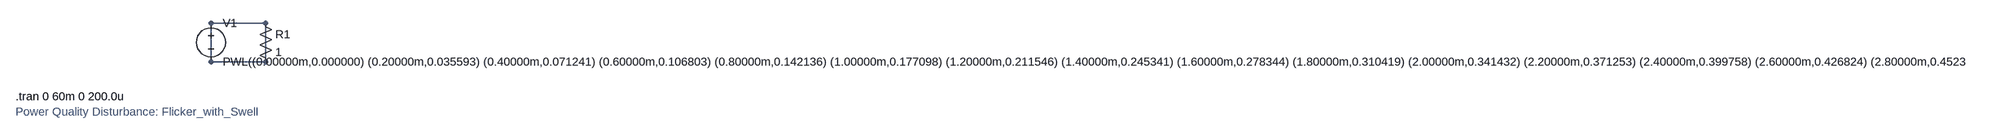
[diagram p0: schematic Flicker_with_Swell.asc]
Flicker_with_Swell.asc, the LTspice schematic file:
Version 4
SHEET 1 880 680
WIRE 192 128 80 128
WIRE 80 128 80 208
WIRE 192 208 80 208
WIRE 192 128 192 208
SYMBOL voltage 80 112 R0
WINDOW 123 0 0 Left 0
WINDOW 39 0 0 Left 0
SYMATTR InstName V1
SYMATTR Value PWL((0.00000m,0.000000) (0.20000m,0.035593) (0.40000m,0.071241) (0.60000m,0.106803) (0.80000m,0.142136) (1.00000m,0.177098) (1.20000m,0.211546) (1.40000m,0.245341) (1.60000m,0.278344) (1.80000m,0.310419) (2.00000m,0.341432) (2.20000m,0.371253) (2.40000m,0.399758) (2.60000m,0.426824) (2.80000m,0.452336) (3.00000m,0.476183) (3.20000m,0.498261) (3.40000m,0.518473) (3.60000m,0.536727) (3.80000m,0.552941) (4.00000m,0.567038) (4.20000m,0.578952) (4.40000m,0.588622) (4.60000m,0.596000) (4.80000m,0.601044) (5.00000m,0.603722) (5.20000m,0.604011) (5.40000m,0.601898) (5.60000m,0.597380) (5.80000m,0.590464) (6.00000m,0.581165) (6.20000m,0.569509) (6.40000m,0.555531) (6.60000m,0.539278) (6.80000m,0.520802) (7.00000m,0.500169) (7.20000m,0.477451) (7.40000m,0.452729) (7.60000m,0.426094) (7.80000m,0.397644) (8.00000m,0.367486) (8.20000m,0.335732) (8.40000m,0.302505) (8.60000m,0.267930) (8.80000m,0.232141) (9.00000m,0.195277) (9.20000m,0.157481) (9.40000m,0.118902) (9.60000m,0.079692) (9.80000m,0.040005) (10.00000m,0.000000) (10.20000m,-0.040164) (10.40000m,-0.080326) (10.60000m,-0.120323) (10.80000m,-0.159995) (11.00000m,-0.199181) (11.20000m,-0.237721) (11.40000m,-0.275457) (11.60000m,-0.312234) (11.80000m,-0.347901) (12.00000m,-0.382310) (12.20000m,-0.415318) (12.40000m,-0.446787) (12.60000m,-0.476586) (12.80000m,-0.504587) (13.00000m,-0.530674) (13.20000m,-0.554733) (13.40000m,-0.576662) (13.60000m,-0.596365) (13.80000m,-0.613756) (14.00000m,-0.628758) (14.20000m,-0.641303) (14.40000m,-0.651332) (14.60000m,-0.658799) (14.80000m,-0.663665) (15.00000m,-0.665904) (15.20000m,-0.665499) (15.40000m,-0.662444) (15.60000m,-0.656745) (15.80000m,-0.648418) (16.00000m,-0.637489) (16.20000m,-0.623996) (16.40000m,-0.607986) (16.60000m,-0.589520) (16.80000m,-0.568664) (17.00000m,-0.545498) (17.20000m,-0.520109) (17.40000m,-0.492596) (17.60000m,-0.463064) (17.80000m,-0.431628) (18.00000m,-0.398412) (18.20000m,-0.363545) (18.40000m,-0.327166) (18.60000m,-0.289417) (18.80000m,-0.250449) (19.00000m,-0.210416) (19.20000m,-0.169479) (19.40000m,-0.127801) (19.60000m,-0.085548) (19.80000m,-0.042891) (20.00000m,-0.000000) (20.20000m,0.062279) (20.40000m,0.124396) (20.60000m,0.186098) (20.80000m,0.247137) (21.00000m,0.307266) (21.20000m,0.366241) (21.40000m,0.423823) (21.60000m,0.479779) (21.80000m,0.533880) (22.00000m,0.585908) (22.20000m,0.635650) (22.40000m,0.682904) (22.60000m,0.727477) (22.80000m,0.769188) (23.00000m,0.807867) (23.20000m,0.843355) (23.40000m,0.875509) (23.60000m,0.904196) (23.80000m,0.929300) (24.00000m,0.950718) (24.20000m,0.968363) (24.40000m,0.982161) (24.60000m,0.992058) (24.80000m,0.998013) (25.00000m,1.000000) (25.20000m,0.998013) (25.40000m,0.992058) (25.60000m,0.982161) (25.80000m,0.968363) (26.00000m,0.950718) (26.20000m,0.929300) (26.40000m,0.904196) (26.60000m,0.875509) (26.80000m,0.843355) (27.00000m,0.807867) (27.20000m,0.769188) (27.40000m,0.727477) (27.60000m,0.682904) (27.80000m,0.635650) (28.00000m,0.585908) (28.20000m,0.533880) (28.40000m,0.479779) (28.60000m,0.423823) (28.80000m,0.366241) (29.00000m,0.307266) (29.20000m,0.247137) (29.40000m,0.186098) (29.60000m,0.124396) (29.80000m,0.062279) (30.00000m,0.000000) (30.20000m,-0.062192) (30.40000m,-0.124045) (30.60000m,-0.185311) (30.80000m,-0.245745) (31.00000m,-0.305104) (31.20000m,-0.363151) (31.40000m,-0.419655) (31.60000m,-0.474390) (31.80000m,-0.527141) (32.00000m,-0.577697) (32.20000m,-0.625861) (32.40000m,-0.671443) (32.60000m,-0.714264) (32.80000m,-0.754158) (33.00000m,-0.790972) (33.20000m,-0.824563) (33.40000m,-0.854804) (33.60000m,-0.881580) (33.80000m,-0.904794) (34.00000m,-0.924358) (34.20000m,-0.940205) (34.40000m,-0.952280) (34.60000m,-0.960544) (34.80000m,-0.964973) (35.00000m,-0.965560) (35.20000m,-0.962314) (35.40000m,-0.955258) (35.60000m,-0.944432) (35.80000m,-0.929889) (36.00000m,-0.911699) (36.20000m,-0.889947) (36.40000m,-0.864729) (36.60000m,-0.836160) (36.80000m,-0.804363) (37.00000m,-0.769477) (37.20000m,-0.731652) (37.40000m,-0.691049) (37.60000m,-0.647841) (37.80000m,-0.602211) (38.00000m,-0.554349) (38.20000m,-0.504456) (38.40000m,-0.452739) (38.60000m,-0.399412) (38.80000m,-0.344695) (39.00000m,-0.288813) (39.20000m,-0.231993) (39.40000m,-0.174469) (39.60000m,-0.116472) (39.80000m,-0.058238) (40.00000m,-0.000000) (40.20000m,0.040005) (40.40000m,0.079692) (40.60000m,0.118902) (40.80000m,0.157481) (41.00000m,0.195277) (41.20000m,0.232141) (41.40000m,0.267930) (41.60000m,0.302505) (41.80000m,0.335732) (42.00000m,0.367486) (42.20000m,0.397644) (42.40000m,0.426094) (42.60000m,0.452729) (42.80000m,0.477451) (43.00000m,0.500169) (43.20000m,0.520802) (43.40000m,0.539278) (43.60000m,0.555531) (43.80000m,0.569509) (44.00000m,0.581165) (44.20000m,0.590464) (44.40000m,0.597380) (44.60000m,0.601898) (44.80000m,0.604011) (45.00000m,0.603722) (45.20000m,0.601044) (45.40000m,0.596000) (45.60000m,0.588622) (45.80000m,0.578952) (46.00000m,0.567038) (46.20000m,0.552941) (46.40000m,0.536727) (46.60000m,0.518473) (46.80000m,0.498261) (47.00000m,0.476183) (47.20000m,0.452336) (47.40000m,0.426824) (47.60000m,0.399758) (47.80000m,0.371253) (48.00000m,0.341432) (48.20000m,0.310419) (48.40000m,0.278344) (48.60000m,0.245341) (48.80000m,0.211546) (49.00000m,0.177098) (49.20000m,0.142136) (49.40000m,0.106803) (49.60000m,0.071241) (49.80000m,0.035593) (50.00000m,0.000000) (50.20000m,-0.035397) (50.40000m,-0.070458) (50.60000m,-0.105047) (50.80000m,-0.139028) (51.00000m,-0.172271) (51.20000m,-0.204649) (51.40000m,-0.236037) (51.60000m,-0.266318) (51.80000m,-0.295378) (52.00000m,-0.323108) (52.20000m,-0.349407) (52.40000m,-0.374179) (52.60000m,-0.397335) (52.80000m,-0.418793) (53.00000m,-0.438477) (53.20000m,-0.456321) (53.40000m,-0.472264) (53.60000m,-0.486254) (53.80000m,-0.498248) (54.00000m,-0.508209) (54.20000m,-0.516111) (54.40000m,-0.521934) (54.60000m,-0.525667) (54.80000m,-0.527307) (55.00000m,-0.526861) (55.20000m,-0.524341) (55.40000m,-0.519769) (55.60000m,-0.513176) (55.80000m,-0.504599) (56.00000m,-0.494083) (56.20000m,-0.481680) (56.40000m,-0.467450) (56.60000m,-0.451459) (56.80000m,-0.433780) (57.00000m,-0.414491) (57.20000m,-0.393678) (57.40000m,-0.371430) (57.60000m,-0.347843) (57.80000m,-0.323016) (58.00000m,-0.297054) (58.20000m,-0.270064) (58.40000m,-0.242158) (58.60000m,-0.213449) (58.80000m,-0.184054) (59.00000m,-0.154092) (59.20000m,-0.123683) (59.40000m,-0.092948) (59.60000m,-0.062008) (59.80000m,-0.030985))
SYMBOL res 176 112 R0
SYMATTR InstName R1
SYMATTR Value 1
TEXT -320 280 Left 2 !.tran 0 60m 0 200.0u
TEXT -320 312 Left 2 ;Power Quality Disturbance: Flicker_with_Swell

The netlist it stands for:
* Flicker_with_Swell.asc
V1 N001 N001 PWL((0.00000m,0.000000) (0.20000m,0.035593) (0.40000m,0.071241) (0.60000m,0.106803) (0.80000m,0.142136) (1.00000m,0.177098) (1.20000m,0.211546) (1.40000m,0.245341) (1.60000m,0.278344) (1.80000m,0.310419) (2.00000m,0.341432) (2.20000m,0.371253) (2.40000m,0.399758) (2.60000m,0.426824) (2.80000m,0.452336) (3.00000m,0.476183) (3.20000m,0.498261) (3.40000m,0.518473) (3.60000m,0.536727) (3.80000m,0.552941) (4.00000m,0.567038) (4.20000m,0.578952) (4.40000m,0.588622) (4.60000m,0.596000) (4.80000m,0.601044) (5.00000m,0.603722) (5.20000m,0.604011) (5.40000m,0.601898) (5.60000m,0.597380) (5.80000m,0.590464) (6.00000m,0.581165) (6.20000m,0.569509) (6.40000m,0.555531) (6.60000m,0.539278) (6.80000m,0.520802) (7.00000m,0.500169) (7.20000m,0.477451) (7.40000m,0.452729) (7.60000m,0.426094) (7.80000m,0.397644) (8.00000m,0.367486) (8.20000m,0.335732) (8.40000m,0.302505) (8.60000m,0.267930) (8.80000m,0.232141) (9.00000m,0.195277) (9.20000m,0.157481) (9.40000m,0.118902) (9.60000m,0.079692) (9.80000m,0.040005) (10.00000m,0.000000) (10.20000m,-0.040164) (10.40000m,-0.080326) (10.60000m,-0.120323) (10.80000m,-0.159995) (11.00000m,-0.199181) (11.20000m,-0.237721) (11.40000m,-0.275457) (11.60000m,-0.312234) (11.80000m,-0.347901) (12.00000m,-0.382310) (12.20000m,-0.415318) (12.40000m,-0.446787) (12.60000m,-0.476586) (12.80000m,-0.504587) (13.00000m,-0.530674) (13.20000m,-0.554733) (13.40000m,-0.576662) (13.60000m,-0.596365) (13.80000m,-0.613756) (14.00000m,-0.628758) (14.20000m,-0.641303) (14.40000m,-0.651332) (14.60000m,-0.658799) (14.80000m,-0.663665) (15.00000m,-0.665904) (15.20000m,-0.665499) (15.40000m,-0.662444) (15.60000m,-0.656745) (15.80000m,-0.648418) (16.00000m,-0.637489) (16.20000m,-0.623996) (16.40000m,-0.607986) (16.60000m,-0.589520) (16.80000m,-0.568664) (17.00000m,-0.545498) (17.20000m,-0.520109) (17.40000m,-0.492596) (17.60000m,-0.463064) (17.80000m,-0.431628) (18.00000m,-0.398412) (18.20000m,-0.363545) (18.40000m,-0.327166) (18.60000m,-0.289417) (18.80000m,-0.250449) (19.00000m,-0.210416) (19.20000m,-0.169479) (19.40000m,-0.127801) (19.60000m,-0.085548) (19.80000m,-0.042891) (20.00000m,-0.000000) (20.20000m,0.062279) (20.40000m,0.124396) (20.60000m,0.186098) (20.80000m,0.247137) (21.00000m,0.307266) (21.20000m,0.366241) (21.40000m,0.423823) (21.60000m,0.479779) (21.80000m,0.533880) (22.00000m,0.585908) (22.20000m,0.635650) (22.40000m,0.682904) (22.60000m,0.727477) (22.80000m,0.769188) (23.00000m,0.807867) (23.20000m,0.843355) (23.40000m,0.875509) (23.60000m,0.904196) (23.80000m,0.929300) (24.00000m,0.950718) (24.20000m,0.968363) (24.40000m,0.982161) (24.60000m,0.992058) (24.80000m,0.998013) (25.00000m,1.000000) (25.20000m,0.998013) (25.40000m,0.992058) (25.60000m,0.982161) (25.80000m,0.968363) (26.00000m,0.950718) (26.20000m,0.929300) (26.40000m,0.904196) (26.60000m,0.875509) (26.80000m,0.843355) (27.00000m,0.807867) (27.20000m,0.769188) (27.40000m,0.727477) (27.60000m,0.682904) (27.80000m,0.635650) (28.00000m,0.585908) (28.20000m,0.533880) (28.40000m,0.479779) (28.60000m,0.423823) (28.80000m,0.366241) (29.00000m,0.307266) (29.20000m,0.247137) (29.40000m,0.186098) (29.60000m,0.124396) (29.80000m,0.062279) (30.00000m,0.000000) (30.20000m,-0.062192) (30.40000m,-0.124045) (30.60000m,-0.185311) (30.80000m,-0.245745) (31.00000m,-0.305104) (31.20000m,-0.363151) (31.40000m,-0.419655) (31.60000m,-0.474390) (31.80000m,-0.527141) (32.00000m,-0.577697) (32.20000m,-0.625861) (32.40000m,-0.671443) (32.60000m,-0.714264) (32.80000m,-0.754158) (33.00000m,-0.790972) (33.20000m,-0.824563) (33.40000m,-0.854804) (33.60000m,-0.881580) (33.80000m,-0.904794) (34.00000m,-0.924358) (34.20000m,-0.940205) (34.40000m,-0.952280) (34.60000m,-0.960544) (34.80000m,-0.964973) (35.00000m,-0.965560) (35.20000m,-0.962314) (35.40000m,-0.955258) (35.60000m,-0.944432) (35.80000m,-0.929889) (36.00000m,-0.911699) (36.20000m,-0.889947) (36.40000m,-0.864729) (36.60000m,-0.836160) (36.80000m,-0.804363) (37.00000m,-0.769477) (37.20000m,-0.731652) (37.40000m,-0.691049) (37.60000m,-0.647841) (37.80000m,-0.602211) (38.00000m,-0.554349) (38.20000m,-0.504456) (38.40000m,-0.452739) (38.60000m,-0.399412) (38.80000m,-0.344695) (39.00000m,-0.288813) (39.20000m,-0.231993) (39.40000m,-0.174469) (39.60000m,-0.116472) (39.80000m,-0.058238) (40.00000m,-0.000000) (40.20000m,0.040005) (40.40000m,0.079692) (40.60000m,0.118902) (40.80000m,0.157481) (41.00000m,0.195277) (41.20000m,0.232141) (41.40000m,0.267930) (41.60000m,0.302505) (41.80000m,0.335732) (42.00000m,0.367486) (42.20000m,0.397644) (42.40000m,0.426094) (42.60000m,0.452729) (42.80000m,0.477451) (43.00000m,0.500169) (43.20000m,0.520802) (43.40000m,0.539278) (43.60000m,0.555531) (43.80000m,0.569509) (44.00000m,0.581165) (44.20000m,0.590464) (44.40000m,0.597380) (44.60000m,0.601898) (44.80000m,0.604011) (45.00000m,0.603722) (45.20000m,0.601044) (45.40000m,0.596000) (45.60000m,0.588622) (45.80000m,0.578952) (46.00000m,0.567038) (46.20000m,0.552941) (46.40000m,0.536727) (46.60000m,0.518473) (46.80000m,0.498261) (47.00000m,0.476183) (47.20000m,0.452336) (47.40000m,0.426824) (47.60000m,0.399758) (47.80000m,0.371253) (48.00000m,0.341432) (48.20000m,0.310419) (48.40000m,0.278344) (48.60000m,0.245341) (48.80000m,0.211546) (49.00000m,0.177098) (49.20000m,0.142136) (49.40000m,0.106803) (49.60000m,0.071241) (49.80000m,0.035593) (50.00000m,0.000000) (50.20000m,-0.035397) (50.40000m,-0.070458) (50.60000m,-0.105047) (50.80000m,-0.139028) (51.00000m,-0.172271) (51.20000m,-0.204649) (51.40000m,-0.236037) (51.60000m,-0.266318) (51.80000m,-0.295378) (52.00000m,-0.323108) (52.20000m,-0.349407) (52.40000m,-0.374179) (52.60000m,-0.397335) (52.80000m,-0.418793) (53.00000m,-0.438477) (53.20000m,-0.456321) (53.40000m,-0.472264) (53.60000m,-0.486254) (53.80000m,-0.498248) (54.00000m,-0.508209) (54.20000m,-0.516111) (54.40000m,-0.521934) (54.60000m,-0.525667) (54.80000m,-0.527307) (55.00000m,-0.526861) (55.20000m,-0.524341) (55.40000m,-0.519769) (55.60000m,-0.513176) (55.80000m,-0.504599) (56.00000m,-0.494083) (56.20000m,-0.481680) (56.40000m,-0.467450) (56.60000m,-0.451459) (56.80000m,-0.433780) (57.00000m,-0.414491) (57.20000m,-0.393678) (57.40000m,-0.371430) (57.60000m,-0.347843) (57.80000m,-0.323016) (58.00000m,-0.297054) (58.20000m,-0.270064) (58.40000m,-0.242158) (58.60000m,-0.213449) (58.80000m,-0.184054) (59.00000m,-0.154092) (59.20000m,-0.123683) (59.40000m,-0.092948) (59.60000m,-0.062008) (59.80000m,-0.030985))
R1 N001 N001 1
.tran 0 60m 0 200.0u
* Power Quality Disturbance: Flicker_with_Swell
.backanno
.end